# Altium schematic sheet Gyro.SchDoc
size A4
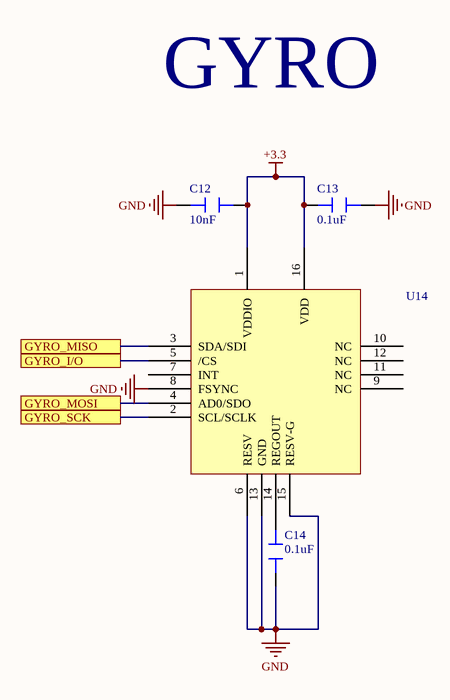
[diagram p0: Gyro.SchDoc]

## Parts
C12  10nF  [CAPACITOR 0805]
C13  0.1uF  [CAPACITOR 0805]
C14  0.1uF  [CAPACITOR 0805]
U14  Gyroscope  [GYROSCOPE]  (value not drawn)

## Ports
GYRO_I/O, GYRO_MISO, GYRO_MOSI, GYRO_SCK

## Nets
+3.3: C12.2 C13.1 U14.1(VDDIO) U14.16(VDD)
GND: C12.1 C13.2 C14.1 U14.6(RESV) U14.8(FSYNC) U14.13(GND) U14.15(RESV-G)
GYRO_I/O: U14.5(/CS) ; port GYRO_I/O
GYRO_MISO: U14.3(SDA/SDI) ; port GYRO_MISO
GYRO_MOSI: U14.4(AD0/SDO) ; port GYRO_MOSI
GYRO_SCK: U14.2(SCL/SCLK) ; port GYRO_SCK
NetC14_2: C14.2 U14.14(REGOUT)

Not connected (* = marked no-connect by the designer): U14 7(INT) 9(NC) 10(NC) 11(NC) 12(NC)

## Notes on the sheet
- GYRO

## Library data of the parts
C12 = Capacitor  10nF 0805: Multilayer Ceramic Capacitors MLCC - SMD/SMT .01uF 50volts 10%; Manufacturer: Vishay Vitramon; Manufacturer Part Number: VJ0805Y103KXAAC; Voltage Rating: 50V; Dielectric: X7R; Supplier 1: Mouser; Stock 1: 543640; Pricing 1: 1=0.26, 10=0.202, 50=0.202, 100=0.09, 500=0.074, 1000=0.051, 3000=0.042, 6000=0.038, 9000=0.033, 10000=0.033, 24000=0.03 (USD); Mount: Surface Mount; Case/Package: 0805; Case Code (Imperial): 0805; Case Code (Metric): 2012; Contact Plating: Tin,Matte; Min Operating Temperature: -55°C; Max Operating Temperature: 125°C; Capacitance: 10nF; Tolerance: 10%; Packaging: Tape and Reel; Voltage Rating (DC): 50V; Package Quantity: 1; Termination: SMD/SMT; Length: 2mm; Height: 1.45mm; Width: 1.25mm; Thickness: 0.057inch; Depth: 1.25mm; Radiation Hardening: No; REACH SVHC: Unknown; Lead Free: Lead Free; ComponentLink1URL: http://www.vishay.com/docs/45051/vjvitramonpackaging.pdf?src-supplier=Digi-Key; ComponentLink1Description: http://www.vishay.com/docs/45051/vjvitramonpackaging.pdf?src-supplier=Digi-Key; ComponentLink2URL: http://www.farnell.com/datasheets/2049140.pdf?src-supplier=Element14; ComponentLink2Description: http://www.farnell.com/datasheets/2049140.pdf?src-supplier=Element14; Category: Multilayer Ceramic Capacitors MLCC - SMD/SMT
C13 C14 = Capacitor  0.1uF 0805: Multilayer Ceramic Capacitors MLCC - SMD/SMT .1uF 50volts 10%; Manufacturer: Vishay Vitramon; Manufacturer Part Number: VJ0805Y104KXAAT; Capacitance: 100nF; Voltage Rating: 50V; Dielectric: X7R; Supplier 1: Mouser; Stock 1: 207342; Pricing 1: 1=0.2, 10=0.2, 50=0.162, 100=0.108, 500=0.095, 1000=0.084, 3000=0.072, 6000=0.069, 9000=0.065, 10000=0.065 (USD); Mount: Surface Mount; Case/Package: 0805; Weight: 0.000194oz; Case Code (Metric): 2012; Case Code (Imperial): 0805; Min Operating Temperature: -55°C; Max Operating Temperature: 125°C; Tolerance: 10%; Package Quantity: 1; Packaging: Tape and Reel; Voltage Rating (DC): 50V; Termination: SMD/SMT; Voltage: 50V; Length: 2mm; Height: 1.45mm; Width: 0.049inch; Thickness: 0.057inch; Depth: 1.25mm; Radiation Hardening: No; REACH SVHC: Unknown; Lead Free: Lead Free; ComponentLink1URL: http://www.mouser.com/ds/2/427/vjcommercialseries-222796.pdf?src-supplier=Mouser; ComponentLink1Description: http://www.mouser.com/ds/2/427/vjcommercialseries-222796.pdf?src-supplier=Mouser; ComponentLink2URL: http://www.vishay.com/docs/45199/vjcommercialseries.pdf?src-supplier=Digi-Key; ComponentLink2Description: http://www.vishay.com/docs/45199/vjcommercialseries.pdf?src-supplier=Digi-Key; ComponentLink3URL: http://www.vishay.com/docs/45199/vjcommercialseries.pdf?src-supplier=Future+Electronics; ComponentLink3Description: http://www.vishay.com/docs/45199/vjcommercialseries.pdf?src-supplier=Future+Electronics; Supplier Part Number 1: 77-VJ0805Y104KXAAT; Category: Multilayer Ceramic Capacitors MLCC - SMD/SMT
U14 = Gyroscope: MEMS GYROSCOPE 1-AXIS 16QFN; Manufacturer: TDK InvenSense; Output Type: SPI,I2C; Axis: Z; Bandwidth: 5Hz; Operating Supply Current: 2.8mA; Supplier 1: Mouser; Manufacturer Part Number: ISZ-2510; Stock 1: 0; Min Operating Temperature: -40°C; Max Operating Temperature: 85°C; Packaging: Tape and Reel; ComponentLink1URL: https://store.invensense.com/datasheets/invensense/PS-ISZ-2510A-00.pdf?src-supplier=Digi-Key; ComponentLink1Description: https://store.invensense.com/datasheets/invensense/PS-ISZ-2510A-00.pdf?src-supplier=Digi-Key; Supplier Part Number 1: 410-ISZ-2510; Category: Gyroscopes